# EAGLE schematic tester (EAGLE 6.6.0)
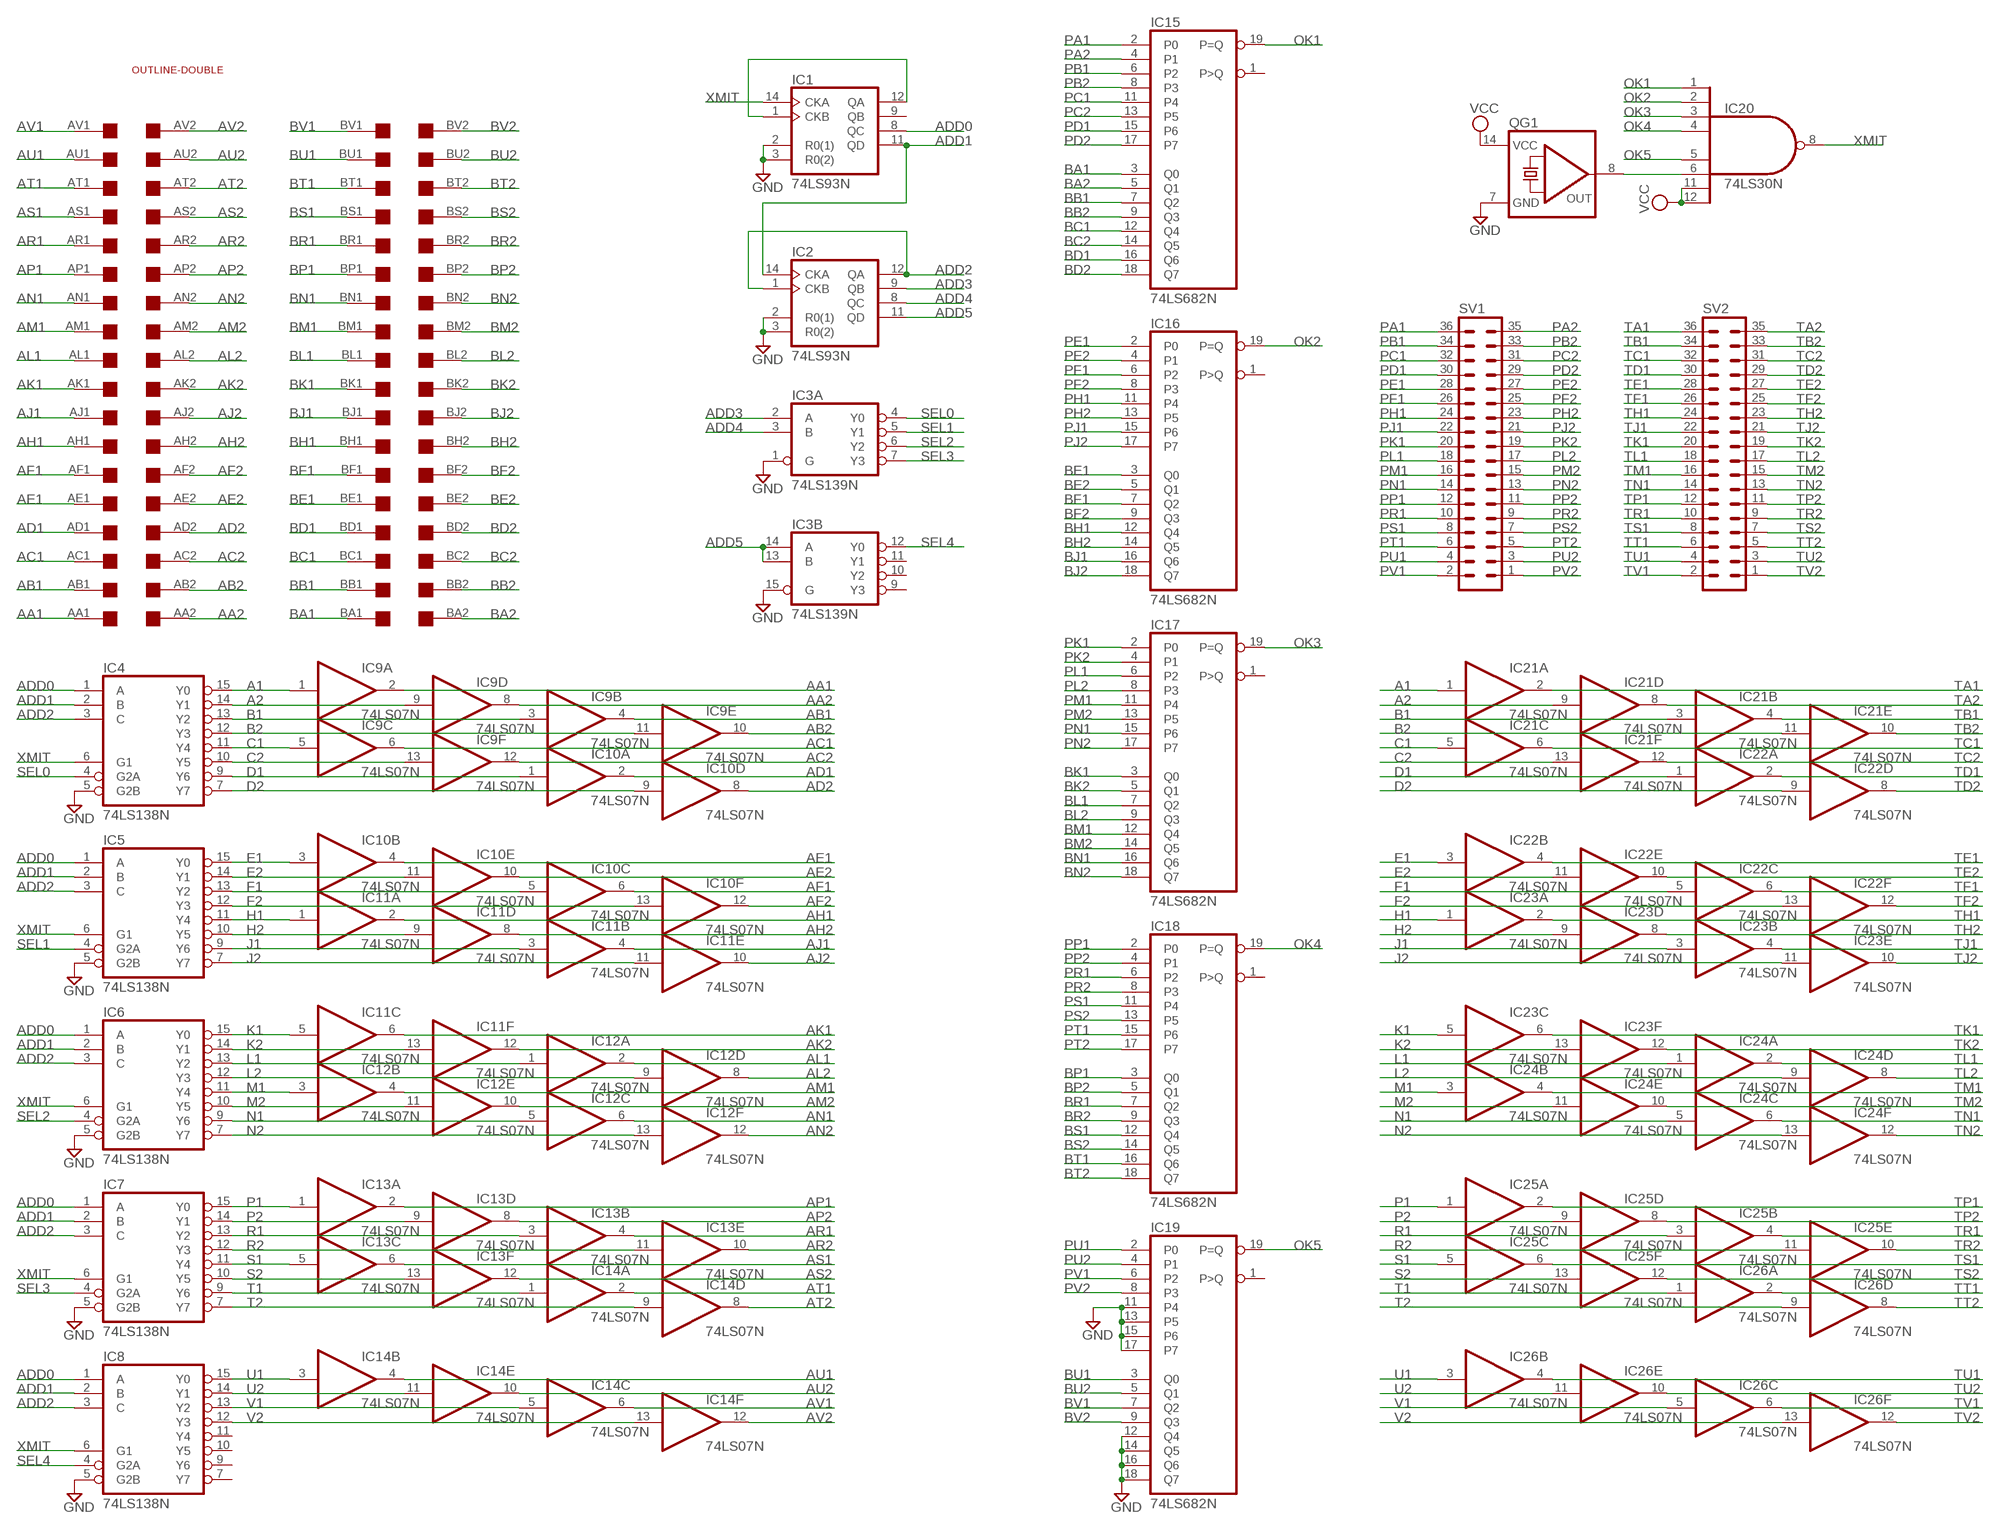
[diagram p0: schematic, sheet 1]

## Parts
IC1  74LS93N  [DIL14]
IC2  74LS93N  [DIL14]
IC3  74LS139N  [DIL16]
IC4  74LS138N  [DIL16]
IC5  74LS138N  [DIL16]
IC6  74LS138N  [DIL16]
IC7  74LS138N  [DIL16]
IC8  74LS138N  [DIL16]
IC9  74LS07N  [DIL14]
IC10  74LS07N  [DIL14]
IC11  74LS07N  [DIL14]
IC12  74LS07N  [DIL14]
IC13  74LS07N  [DIL14]
IC14  74LS07N  [DIL14]
IC15  74LS682N  [DIL20]
IC16  74LS682N  [DIL20]
IC17  74LS682N  [DIL20]
IC18  74LS682N  [DIL20]
IC19  74LS682N  [DIL20]
IC20  74LS30N  [DIL14]
IC21  74LS07N  [DIL14]
IC22  74LS07N  [DIL14]
IC23  74LS07N  [DIL14]
IC24  74LS07N  [DIL14]
IC25  74LS07N  [DIL14]
IC26  74LS07N  [DIL14]
QG1  QG5860  [DIL14S]
SV1  MA18-2  [MA18-2]
SV2  MA18-2  [MA18-2]
U$1  DOUBLE  [EDGE-CON4]
U$2  OUTLINE-DOUBLE  [DOUBLE]

## Nets
A1: IC4.15(Y0) IC9.1(A:I) IC21.1(A:I)
A2: IC4.14(Y1) IC9.9(D:I) IC21.9(D:I)
AA1: IC9.2(A:O) U$1.AA1
AA2: IC9.8(D:O) U$1.AA2
AB1: IC9.4(B:O) U$1.AB1
AB2: IC9.10(E:O) U$1.AB2
AC1: IC9.6(C:O) U$1.AC1
AC2: IC9.12(F:O) U$1.AC2
AD1: IC10.2(A:O) U$1.AD1
AD2: IC10.8(D:O) U$1.AD2
ADD0: IC1.8(QC) IC4.1(A) IC5.1(A) IC6.1(A) IC7.1(A) IC8.1(A)
ADD1: IC1.11(QD) IC2.14(CKA) IC4.2(B) IC5.2(B) IC6.2(B) IC7.2(B) IC8.2(B)
ADD2: IC2.1(CKB) IC2.12(QA) IC4.3(C) IC5.3(C) IC6.3(C) IC7.3(C) IC8.3(C)
ADD3: IC2.9(QB) IC3.2(A:A)
ADD4: IC2.8(QC) IC3.3(A:B)
ADD5: IC2.11(QD) IC3.13(B:B) IC3.14(B:A)
AE1: IC10.4(B:O) U$1.AE1
AE2: IC10.10(E:O) U$1.AE2
AF1: IC10.6(C:O) U$1.AF1
AF2: IC10.12(F:O) U$1.AF2
AH1: IC11.2(A:O) U$1.AH1
AH2: IC11.8(D:O) U$1.AH2
AJ1: IC11.4(B:O) U$1.AJ1
AJ2: IC11.10(E:O) U$1.AJ2
AK1: IC11.6(C:O) U$1.AK1
AK2: IC11.12(F:O) U$1.AK2
AL1: IC12.2(A:O) U$1.AL1
AL2: IC12.8(D:O) U$1.AL2
AM1: IC12.4(B:O) U$1.AM1
AM2: IC12.10(E:O) U$1.AM2
AN1: IC12.6(C:O) U$1.AN1
AN2: IC12.12(F:O) U$1.AN2
AP1: IC13.2(A:O) U$1.AP1
AP2: IC13.8(D:O) U$1.AP2
AR1: IC13.4(B:O) U$1.AR1
AR2: IC13.10(E:O) U$1.AR2
AS1: IC13.6(C:O) U$1.AS1
AS2: IC13.12(F:O) U$1.AS2
AT1: IC14.2(A:O) U$1.AT1
AT2: IC14.8(D:O) U$1.AT2
AU1: IC14.4(B:O) U$1.AU1
AU2: IC14.10(E:O) U$1.AU2
AV1: IC14.6(C:O) U$1.AV1
AV2: IC14.12(F:O) U$1.AV2
B1: IC4.13(Y2) IC9.3(B:I) IC21.3(B:I)
B2: IC4.12(Y3) IC9.11(E:I) IC21.11(E:I)
BA1: IC15.3(Q0) U$1.BA1
BA2: IC15.5(Q1) U$1.BA2
BB1: IC15.7(Q2) U$1.BB1
BB2: IC15.9(Q3) U$1.BB2
BC1: IC15.12(Q4) U$1.BC1
BC2: IC15.14(Q5) U$1.BC2
BD1: IC15.16(Q6) U$1.BD1
BD2: IC15.18(Q7) U$1.BD2
BE1: IC16.3(Q0) U$1.BE1
BE2: IC16.5(Q1) U$1.BE2
BF1: IC16.7(Q2) U$1.BF1
BF2: IC16.9(Q3) U$1.BF2
BH1: IC16.12(Q4) U$1.BH1
BH2: IC16.14(Q5) U$1.BH2
BJ1: IC16.16(Q6) U$1.BJ1
BJ2: IC16.18(Q7) U$1.BJ2
BK1: IC17.3(Q0) U$1.BK1
BK2: IC17.5(Q1) U$1.BK2
BL1: IC17.7(Q2) U$1.BL1
BL2: IC17.9(Q3) U$1.BL2
BM1: IC17.12(Q4) U$1.BM1
BM2: IC17.14(Q5) U$1.BM2
BN1: IC17.16(Q6) U$1.BN1
BN2: IC17.18(Q7) U$1.BN2
BP1: IC18.3(Q0) U$1.BP1
BP2: IC18.5(Q1) U$1.BP2
BR1: IC18.7(Q2) U$1.BR1
BR2: IC18.9(Q3) U$1.BR2
BS1: IC18.12(Q4) U$1.BS1
BS2: IC18.14(Q5) U$1.BS2
BT1: IC18.16(Q6) U$1.BT1
BT2: IC18.18(Q7) U$1.BT2
BU1: IC19.3(Q0) U$1.BU1
BU2: IC19.5(Q1) U$1.BU2
BV1: IC19.7(Q2) U$1.BV1
BV2: IC19.9(Q3) U$1.BV2
C1: IC4.11(Y4) IC9.5(C:I) IC21.5(C:I)
C2: IC4.10(Y5) IC9.13(F:I) IC21.13(F:I)
CLK1: IC1.1(CKB) IC1.12(QA)
D1: IC4.9(Y6) IC10.1(A:I) IC22.1(A:I)
D2: IC4.7(Y7) IC10.9(D:I) IC22.9(D:I)
E1: IC5.15(Y0) IC10.3(B:I) IC22.3(B:I)
E2: IC5.14(Y1) IC10.11(E:I) IC22.11(E:I)
F1: IC5.13(Y2) IC10.5(C:I) IC22.5(C:I)
F2: IC5.12(Y3) IC10.13(F:I) IC22.13(F:I)
GND: IC1.2(R0(1)) IC1.3(R0(2)) IC2.2(R0(1)) IC2.3(R0(2)) IC3.1(A:G) IC3.15(B:G) IC4.5(G2B) IC5.5(G2B) IC6.5(G2B) IC7.5(G2B) IC8.5(G2B) IC19.11(P4) IC19.12(Q4) IC19.13(P5) IC19.14(Q5) IC19.15(P6) IC19.16(Q6) IC19.17(P7) IC19.18(Q7) QG1.7(GND)
H1: IC5.11(Y4) IC11.1(A:I) IC23.1(A:I)
H2: IC5.10(Y5) IC11.9(D:I) IC23.9(D:I)
J1: IC5.9(Y6) IC11.3(B:I) IC23.3(B:I)
J2: IC5.7(Y7) IC11.11(E:I) IC23.11(E:I)
K1: IC6.15(Y0) IC11.5(C:I) IC23.5(C:I)
K2: IC6.14(Y1) IC11.13(F:I) IC23.13(F:I)
L1: IC6.13(Y2) IC12.1(A:I) IC24.1(A:I)
L2: IC6.12(Y3) IC12.9(D:I) IC24.9(D:I)
M1: IC6.11(Y4) IC12.3(B:I) IC24.3(B:I)
M2: IC6.10(Y5) IC12.11(E:I) IC24.11(E:I)
N1: IC6.9(Y6) IC12.5(C:I) IC24.5(C:I)
N2: IC6.7(Y7) IC12.13(F:I) IC24.13(F:I)
N$1: IC20.6(I5) QG1.8(OUT)
OK1: IC15.19(P=Q) IC20.1(I0)
OK2: IC16.19(P=Q) IC20.2(I1)
OK3: IC17.19(P=Q) IC20.3(I2)
OK4: IC18.19(P=Q) IC20.4(I3)
OK5: IC19.19(P=Q) IC20.5(I4)
P1: IC7.15(Y0) IC13.1(A:I) IC25.1(A:I)
P2: IC7.14(Y1) IC13.9(D:I) IC25.9(D:I)
PA1: IC15.2(P0) SV1.36
PA2: IC15.4(P1) SV1.35
PB1: IC15.6(P2) SV1.34
PB2: IC15.8(P3) SV1.33
PC1: IC15.11(P4) SV1.32
PC2: IC15.13(P5) SV1.31
PD1: IC15.15(P6) SV1.30
PD2: IC15.17(P7) SV1.29
PE1: IC16.2(P0) SV1.28
PE2: IC16.4(P1) SV1.27
PF1: IC16.6(P2) SV1.26
PF2: IC16.8(P3) SV1.25
PH1: IC16.11(P4) SV1.24
PH2: IC16.13(P5) SV1.23
PJ1: IC16.15(P6) SV1.22
PJ2: IC16.17(P7) SV1.21
PK1: IC17.2(P0) SV1.20
PK2: IC17.4(P1) SV1.19
PL1: IC17.6(P2) SV1.18
PL2: IC17.8(P3) SV1.17
PM1: IC17.11(P4) SV1.16
PM2: IC17.13(P5) SV1.15
PN1: IC17.15(P6) SV1.14
PN2: IC17.17(P7) SV1.13
PP1: IC18.2(P0) SV1.12
PP2: IC18.4(P1) SV1.11
PR1: IC18.6(P2) SV1.10
PR2: IC18.8(P3) SV1.9
PS1: IC18.11(P4) SV1.8
PS2: IC18.13(P5) SV1.7
PT1: IC18.15(P6) SV1.6
PT2: IC18.17(P7) SV1.5
PU1: IC19.2(P0) SV1.4
PU2: IC19.4(P1) SV1.3
PV1: IC19.6(P2) SV1.2
PV2: IC19.8(P3) SV1.1
R1: IC7.13(Y2) IC13.3(B:I) IC25.3(B:I)
R2: IC7.12(Y3) IC13.11(E:I) IC25.11(E:I)
S1: IC7.11(Y4) IC13.5(C:I) IC25.5(C:I)
S2: IC7.10(Y5) IC13.13(F:I) IC25.13(F:I)
SEL0: IC3.4(A:Y0) IC4.4(G2A)
SEL1: IC3.5(A:Y1) IC5.4(G2A)
SEL2: IC3.6(A:Y2) IC6.4(G2A)
SEL3: IC3.7(A:Y3) IC7.4(G2A)
SEL4: IC3.12(B:Y0) IC8.4(G2A)
T1: IC7.9(Y6) IC14.1(A:I) IC26.1(A:I)
T2: IC7.7(Y7) IC14.9(D:I) IC26.9(D:I)
TA1: IC21.2(A:O) SV2.36
TA2: IC21.8(D:O) SV2.35
TB1: IC21.4(B:O) SV2.34
TB2: IC21.10(E:O) SV2.33
TC1: IC21.6(C:O) SV2.32
TC2: IC21.12(F:O) SV2.31
TD1: IC22.2(A:O) SV2.30
TD2: IC22.8(D:O) SV2.29
TE1: IC22.4(B:O) SV2.28
TE2: IC22.10(E:O) SV2.27
TF1: IC22.6(C:O) SV2.26
TF2: IC22.12(F:O) SV2.25
TH1: IC23.2(A:O) SV2.24
TH2: IC23.8(D:O) SV2.23
TJ1: IC23.4(B:O) SV2.22
TJ2: IC23.10(E:O) SV2.21
TK1: IC23.6(C:O) SV2.20
TK2: IC23.12(F:O) SV2.19
TL1: IC24.2(A:O) SV2.18
TL2: IC24.8(D:O) SV2.17
TM1: IC24.4(B:O) SV2.16
TM2: IC24.10(E:O) SV2.15
TN1: IC24.6(C:O) SV2.14
TN2: IC24.12(F:O) SV2.13
TP1: IC25.2(A:O) SV2.12
TP2: IC25.8(D:O) SV2.11
TR1: IC25.4(B:O) SV2.10
TR2: IC25.10(E:O) SV2.9
TS1: IC25.6(C:O) SV2.8
TS2: IC25.12(F:O) SV2.7
TT1: IC26.2(A:O) SV2.6
TT2: IC26.8(D:O) SV2.5
TU1: IC26.4(B:O) SV2.4
TU2: IC26.10(E:O) SV2.3
TV1: IC26.6(C:O) SV2.2
TV2: IC26.12(F:O) SV2.1
U1: IC8.15(Y0) IC14.3(B:I) IC26.3(B:I)
U2: IC8.14(Y1) IC14.11(E:I) IC26.11(E:I)
V1: IC8.13(Y2) IC14.5(C:I) IC26.5(C:I)
V2: IC8.12(Y3) IC14.13(F:I) IC26.13(F:I)
VCC: IC20.11(I6) IC20.12(I7) QG1.14(VCC)
XMIT: IC1.14(CKA) IC4.6(G1) IC5.6(G1) IC6.6(G1) IC7.6(G1) IC8.6(G1) IC20.8(O)
Unconnected: IC1.9(QB) IC3.9(B:Y3) IC3.10(B:Y2) IC3.11(B:Y1) IC8.7(Y7) IC8.9(Y6) IC8.10(Y5) IC8.11(Y4) IC15.1(P>Q) IC16.1(P>Q) IC17.1(P>Q) IC18.1(P>Q) IC19.1(P>Q)

## Power pins joined to a net without a drawn wire
GND: IC1.10(GND) IC2.10(GND) IC3.8(P:GND) IC4.8(GND) IC5.8(GND) IC6.8(GND) IC7.8(GND) IC8.8(GND) IC9.7(P:GND) IC10.7(P:GND) IC11.7(P:GND) IC12.7(P:GND) IC13.7(P:GND) IC14.7(P:GND) IC15.10(GND) IC16.10(GND) IC17.10(GND) IC18.10(GND) IC19.10(GND) IC20.7(GND) IC21.7(P:GND) IC22.7(P:GND) IC23.7(P:GND) IC24.7(P:GND) IC25.7(P:GND) IC26.7(P:GND)
VCC: IC1.5(VCC) IC2.5(VCC) IC3.16(P:VCC) IC4.16(VCC) IC5.16(VCC) IC6.16(VCC) IC7.16(VCC) IC8.16(VCC) IC9.14(P:VCC) IC10.14(P:VCC) IC11.14(P:VCC) IC12.14(P:VCC) IC13.14(P:VCC) IC14.14(P:VCC) IC15.20(VCC) IC16.20(VCC) IC17.20(VCC) IC18.20(VCC) IC19.20(VCC) IC20.14(VCC) IC21.14(P:VCC) IC22.14(P:VCC) IC23.14(P:VCC) IC24.14(P:VCC) IC25.14(P:VCC) IC26.14(P:VCC)

## Library data of the parts
IC1 IC2 = 74xx-us:74*93: Decade, divide by twelve and binary COUNTER
IC3 = 74xx-us:74*139: Dual 2-line to 4-line DECODER/DEMULTIPLEXER
IC4-IC8 = 74xx-us:74*138: 3-line to 8-line DECODER/DEMULTIPLEXER
IC9-IC14 IC21-IC26 = 74xx-us:74*07: Hex BUFFER, open collector high-voltage output
IC15-IC19 = 74xx-us:74*682: 8-bit MAGNITUDE/IDENTITY COMPARATOR, totem pole
IC20 = 74xx-us:74*30: 8-input NAND gate
QG1 = crystal:QG5860: CRYSTAL RESONATOR; OC_FARNELL: unknown; OC_NEWARK: unknown
SV1 SV2 = con-lstb:MA18-2: PIN HEADER; OC_FARNELL: unknown; OC_NEWARK: unknown
U$1 = dec-con:DOUBLE: Double-Height DEC board
U$2 = dec-con:OUTLINE-*: Board outlines for DEC boards.